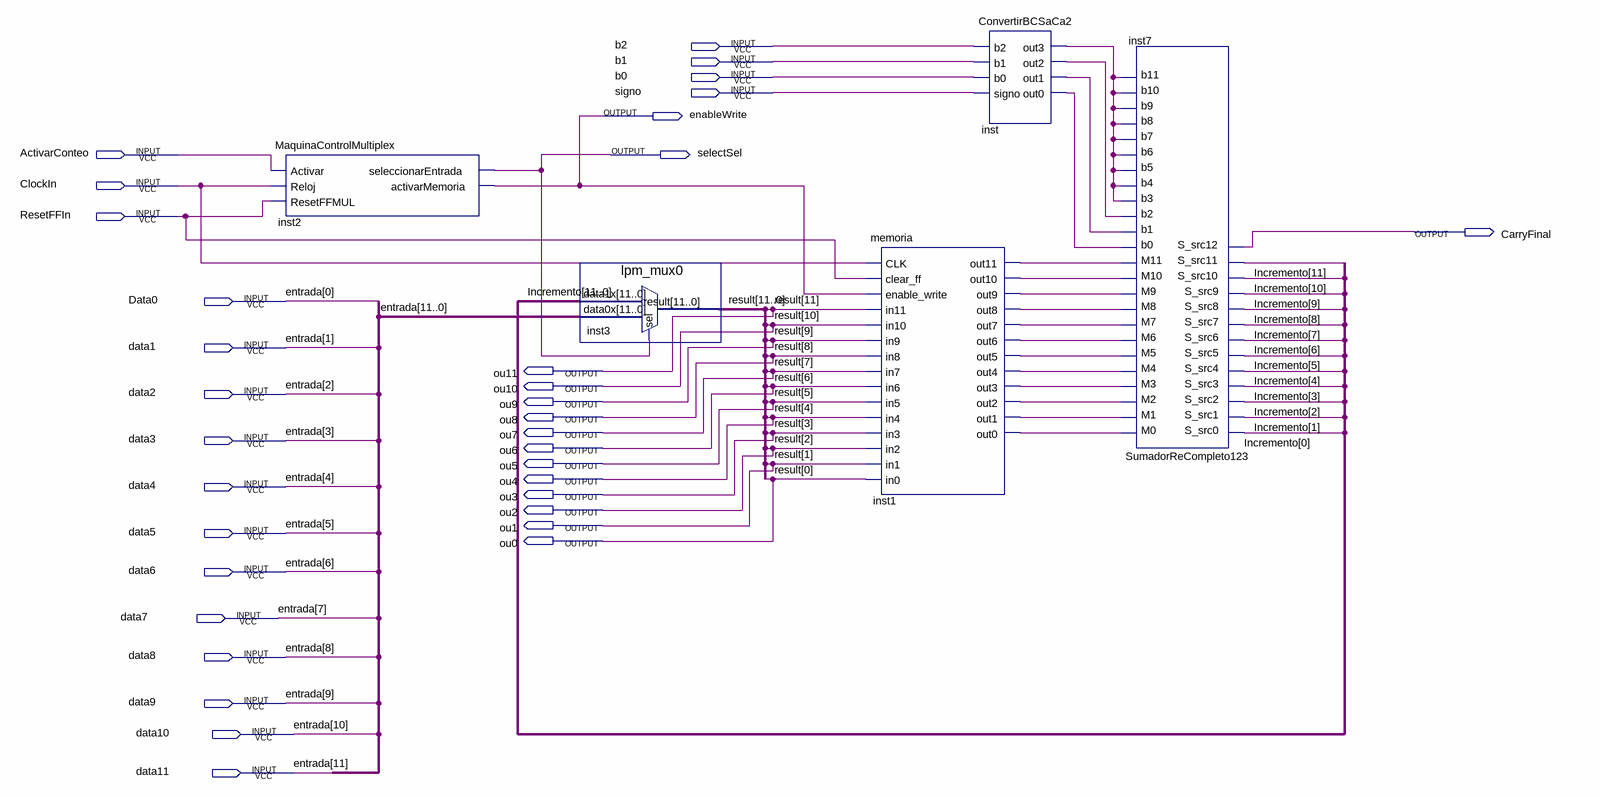
[diagram p0: schematic sheet]
// Quartus schematic Incrementador.bdf as structural Verilog: 5 symbols, 34 pins
module Incrementador (
  input  b2,
  input  b1,
  input  b0,
  input  signo,
  input  ActivarConteo,
  input  ClockIn,
  input  ResetFFIn,
  input  Data0,
  input  data1,
  input  data2,
  input  data3,
  input  data4,
  input  data5,
  input  data6,
  input  data7,
  input  data8,
  input  data9,
  input  data10,
  input  data11,
  output enableWrite,
  output selectSel,
  output CarryFinal,
  output ou11,
  output ou10,
  output ou9,
  output ou8,
  output ou7,
  output ou6,
  output ou5,
  output ou4,
  output ou3,
  output ou2,
  output ou1,
  output ou0
);

  wire inst1_out0, inst1_out1, inst1_out2, inst1_out3, inst1_out4, inst1_out5, inst1_out6, inst1_out7,
       inst1_out8, inst1_out9, inst1_out10, inst1_out11, inst_out0, inst_out1, inst_out2, inst_out3;
  wire [11:0] Incremento;

  MaquinaControlMultiplex inst2 (
    .Activar(ActivarConteo), .Reloj(ClockIn), .ResetFFMUL(ResetFFIn), .seleccionarEntrada(selectSel),
    .activarMemoria(enableWrite));
  lpm_mux0 inst3 (
    .data1x(Incremento),
    .data0x({data11, data10, data9, data8, data7, data6, data5, data4, data3, data2, data1, Data0}),
    .sel(selectSel), .result({ou11, ou10, ou9, ou8, ou7, ou6, ou5, ou4, ou3, ou2, ou1, ou0}));
  memoria inst1 (
    .CLK(ClockIn), .clear_ff(ResetFFIn), .enable_write(enableWrite), .in11(ou11), .in10(ou10), .in9(ou9),
    .in8(ou8), .in7(ou7), .in6(ou6), .in5(ou5), .in4(ou4), .in3(ou3), .in2(ou2), .in1(ou1), .in0(ou0),
    .out11(inst1_out11), .out10(inst1_out10), .out9(inst1_out9), .out8(inst1_out8), .out7(inst1_out7),
    .out6(inst1_out6), .out5(inst1_out5), .out4(inst1_out4), .out3(inst1_out3), .out2(inst1_out2),
    .out1(inst1_out1), .out0(inst1_out0));
  ConvertirBCSaCa2 inst (
    .b2(b2), .b1(b1), .b0(b0), .signo(signo), .out3(inst_out3), .out2(inst_out2), .out1(inst_out1),
    .out0(inst_out0));
  SumadorReCompleto123 inst7 (
    .M0(inst1_out0), .M1(inst1_out1), .M2(inst1_out2), .M3(inst1_out3), .M4(inst1_out4), .M5(inst1_out5),
    .M6(inst1_out6), .M7(inst1_out7), .M8(inst1_out8), .M9(inst1_out9), .M10(inst1_out10), .M11(inst1_out11),
    .b0(inst_out0), .b1(inst_out1), .b2(inst_out2), .b3(inst_out3), .b4(inst_out3), .b5(inst_out3),
    .b6(inst_out3), .b7(inst_out3), .b8(inst_out3), .b9(inst_out3), .b10(inst_out3), .b11(inst_out3),
    .S_src0(Incremento[0]), .S_src1(Incremento[1]), .S_src2(Incremento[2]), .S_src3(Incremento[3]),
    .S_src4(Incremento[4]), .S_src5(Incremento[5]), .S_src6(Incremento[6]), .S_src7(Incremento[7]),
    .S_src8(Incremento[8]), .S_src9(Incremento[9]), .S_src10(Incremento[10]), .S_src11(Incremento[11]),
    .S_src12(CarryFinal));

  // Other names for the same wires on the sheet: entrada[11:0] = {data11, data10, data9, data8, data7, data6, data5, data4, data3, data2, data1, Data0};
  //   result[11:0] = {ou11, ou10, ou9, ou8, ou7, ou6, ou5, ou4, ou3, ou2, ou1, ou0}
endmodule
